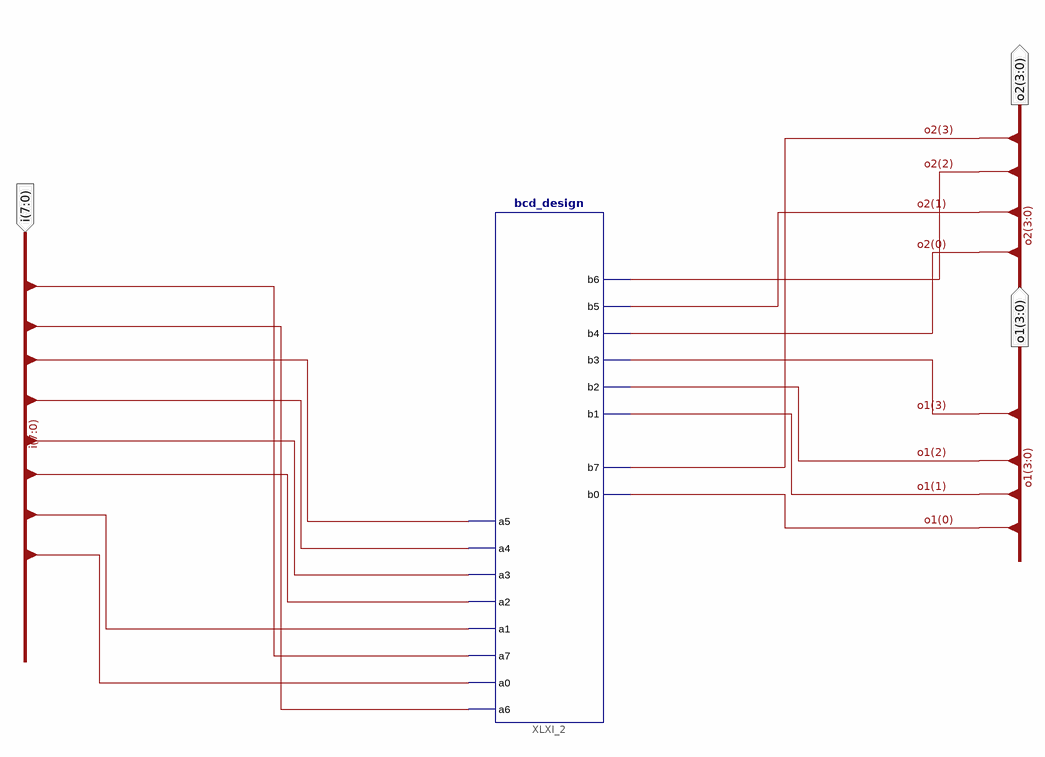
[diagram p0: schematic sheet 1]
// Xilinx ISE schematic bcd2_design.sch (spartan3) as structural Verilog: 1 symbols, 3 ports
module bcd2_design (
  input  [7:0] i,
  output [3:0] o2,
  output [3:0] o1
);

  bcd_design XLXI_2 (
    .a0(i[0]), .a7(i[7]), .a5(i[5]), .a4(i[4]), .a3(i[3]), .a2(i[2]), .a1(i[1]), .b6(o2[2]), .b5(o2[1]),
    .b4(o2[0]), .b3(o1[3]), .b2(o1[2]), .b1(o1[1]), .b0(o1[0]), .b7(o2[3]), .a6(i[6]));
endmodule
